# Altium schematic sheet ParentBoardV2.SchDoc: The conductor main board
size Letter; DrawnBy: IHC,CGH; Organization: The conductor; DocumentNumber: 1; Revision: 4; SheetNumber: 1; SheetTotal: 1
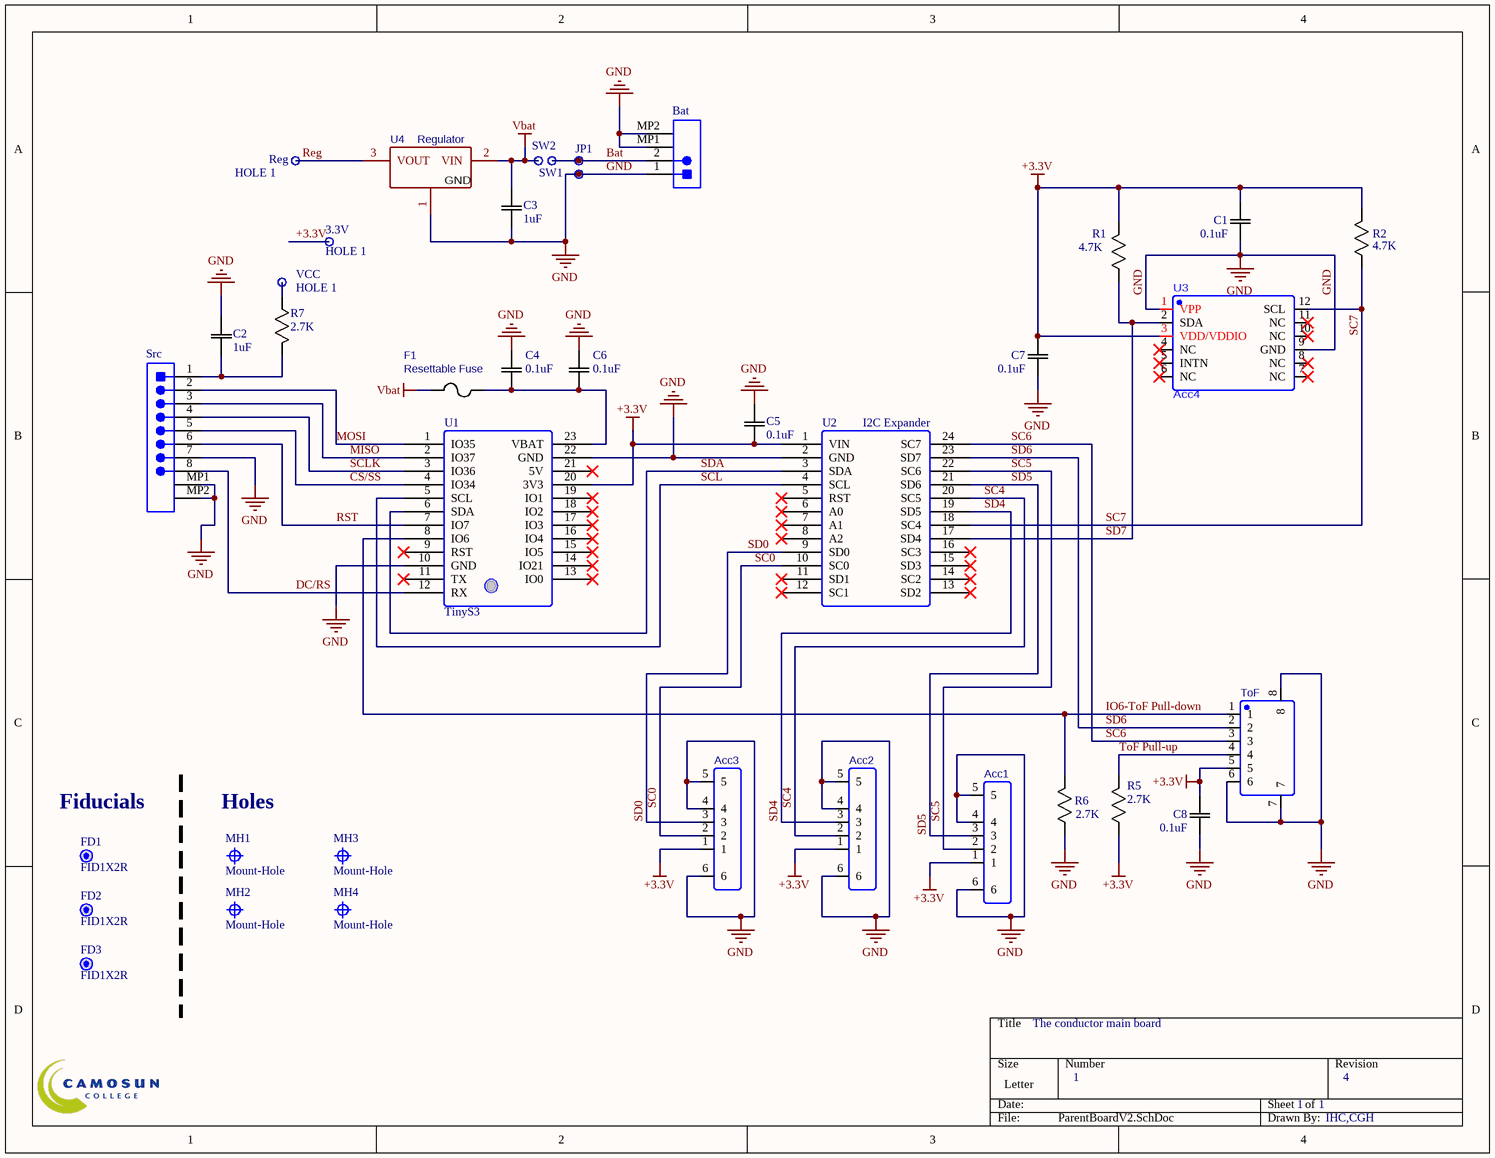
[diagram p0: ParentBoardV2.SchDoc]

## Parts
3.3V  HOLE 1  [RAD0.1C]
Acc1  SM04B-SRSS  [CONN-SMD_4P-P1.00_SM04B-SRSS-TB-LF-SN]  (value not drawn)
Acc2  SM04B-SRSS  [CONN-SMD_4P-P1.00_SM04B-SRSS-TB-LF-SN]  (value not drawn)
Acc3  SM04B-SRSS  [CONN-SMD_4P-P1.00_SM04B-SRSS-TB-LF-SN]  (value not drawn)
Bat  CN-1P-2M-R2  [JST- S2B-PH-SM4-TB(LF)(SN)-2_V]  (value not drawn)
C1  0.1uF  [CAP_AMK107BJ475MK-T_TAY]
C2  1uF  [CAP_AMK107BJ475MK-T_TAY]
C3  1uF  [CAP_AMK107BJ475MK-T_TAY]
C4  0.1uF  [CAP_AMK107BJ475MK-T_TAY]
C5  0.1uF  [CAP_AMK107BJ475MK-T_TAY]
C6  0.1uF  [CAP_AMK107BJ475MK-T_TAY]
C7  0.1uF  [CAP_AMK107BJ475MK-T_TAY]
C8  0.1uF  [CAP_AMK107BJ475MK-T_TAY]
F1  Resettable Fuse  [F0805]
FD1  FID1X2R  [Fiducial]
FD2  FID1X2R  [Fiducial]
FD3  FID1X2R  [Fiducial]
JP1  Battery  [RAD0.1]  (value not drawn)
MH1  Mount-Hole  [support 2 mm]
MH2  Mount-Hole  [support 2 mm]
MH3  Mount-Hole  [support 2 mm]
MH4  Mount-Hole  [support 2 mm]
R1  4.7K  [RC0603N_YAG]
R2  4.7K  [RC0603N_YAG]
R5  2.7K  [RC0603N_YAG]
R6  2.7K  [RC0603N_YAG]
R7  2.7K  [RC0603N_YAG]
Reg  HOLE 1  [RAD0.1C]
Src  SM08B-SRSS-TB(LF)(SN)  [JST-SM08B-SRSS-TB_V]  (value not drawn)
SW1  HOLE 1  [RAD0.1C]  (value not drawn)
SW2  HOLE 1  [RAD0.1C]  (value not drawn)
ToF  ToF sensor connector  [CONN-SMD_SM06B-SRSS-TB-LF-SN]  (value not drawn)
U1  TinyS3  [TinyS3]
U2  I2C Expander  [MODULE_2717]
U3  Acc4  [LGA-12_L2.0-W2.0-P0.50-BL]
U4  Regulator  [SOT89-150P350X160-3N]
VCC  HOLE 1  [RAD0.1C]

## Nets
+3.3V: 3.3V.1 Acc1.1 Acc2.1 Acc3.1 C1.2 C5.1 C7.2 C8.2 R1.1 R2.1 R5.2 ToF.5 U1.20(3V3) U2.1(VIN) U3.3(VDD/VDDIO)
GND: Acc1.4 Acc1.5 Acc1.6 Acc2.4 Acc2.5 Acc2.6 Acc3.4 Acc3.5 Acc3.6 Bat.1 Bat.MP1 Bat.MP2 C1.1 C2.2 C3.1 C4.2 C5.2 C6.2 C7.1 C8.1 JP1.1 R6.2 Src.7 Src.MP1 Src.MP2 ToF.6 ToF.7 ToF.8 U1.10(GND) U1.22(GND) U2.2(GND) U3.1(VPP) U3.9(GND) U4.1(GND)
Vbat: C3.2 F1.2 SW2.1 U4.2(VIN)
Bat: Bat.2 JP1.2 SW1.1
CS/SS: Src.5 U1.4(IO34)
DC/RS: Src.8 U1.12(RX)
IO6-ToF Pull-down: R6.1 ToF.1 U1.8(IO6)
MISO: Src.3 U1.2(IO37)
MOSI: Src.2 U1.1(IO35)
Reg: Reg.1 U4.3(VOUT)
RST: Src.6 U1.7(IO7)
SC0: Acc3.2 U2.10(SC0)
SC4: Acc2.2 U2.20(SC5)
SC5: Acc1.2 U2.22(SC6)
SC6: ToF.3 U2.24(SC7)
SC7: R2.2 U2.18(SC4) U3.12(SCL)
SCL: U1.5(SCL) U2.4(SCL)
SCLK: Src.4 U1.3(IO36)
SD0: Acc3.3 U2.9(SD0)
SD4: Acc2.3 U2.19(SD5)
SD5: Acc1.3 U2.21(SD6)
SD6: ToF.2 U2.23(SD7)
SD7: R1.2 U2.17(SD4) U3.2(SDA)
SDA: U1.6(SDA) U2.3(SDA)
ToF Pull-up: R5.1 ToF.4
NetC2_1: C2.1 R7.1 Src.1
NetC4_1: C4.1 C6.1 F1.1 U1.23(VBAT)
NetR7_2: R7.2 VCC.1

Not connected (* = marked no-connect by the designer): U1 9(RST)* 11(TX)* 13(IO0)* 14(IO21)* 15(IO5)* 16(IO4)* 17(IO3)* 18(IO2)* 19(IO1)* 21(5V)*; U2 5(RST)* 6(A0)* 7(A1)* 8(A2)* 11(SD1)* 12(SC1)* 13(SD2)* 14(SC2)* 15(SD3)* 16(SC3)*; U3 4(NC)* 5(INTN)* 6(NC)* 7(NC)* 8(NC)* 10(NC)* 11(NC)*

## Notes on the sheet
- (near FD1) Fiducials
- (near MH1) Holes

## Library data of the parts
Acc1-Acc3 = SM04B-SRSS-TB (LF)(SN): 4 pin JST connector; Contributor: LCSC; Supplier: LCSC; Supplier Part: C160404; Manufacturer: JST; Manufacturer Part: SM04B-SRSS-TB(LF)(SN); JLCPCB Part Class: Extended Part; spicePre: C; spiceSymbolName: SM04B-SRSS-TB (LF)(SN); LCSC PART #: C160404
Bat = CN-1P-2M-R2: 2 pin connector SMT 2 mm pitch; LCSC PART #: C295747
C1 C4-C8 = CL10B104KB8NNNC: SMT Capacitor 0.1 uF; Mfr_Name: Taiyo Yuden; Manufacturer_Part_Number: AMK107BJ475MK-T; Type: DEV; Copyright: Copyright (C) 2023 Ultra Librarian. All rights reserved.; Digi-Key_Part_Number_1: 587-2228-1-ND; Digi-Key_Part_Number_2: 587-2228-2-ND; Digi-Key_Part_Number_3: 587-2228-6-ND; RefDes: RefDes; LCSC PART #: C1591
C2 C3 = CL10B105KQ8NNNC: SMT Capacitor 1 uF; Mfr_Name: Taiyo Yuden; Manufacturer_Part_Number: AMK107BJ475MK-T; Type: DEV; Copyright: Copyright (C) 2023 Ultra Librarian. All rights reserved.; Digi-Key_Part_Number_1: 587-2228-1-ND; Digi-Key_Part_Number_2: 587-2228-2-ND; Digi-Key_Part_Number_3: 587-2228-6-ND; RefDes: RefDes; LCSC PART #: C105524
F1 = 0805L035YR: 6V 350mA 100A 750mA 0805 Resettable Fuses ROHS; Manufacturer: Littelfuse(美国力特); Contributor: LCSC; Supplier: LCSC; Supplier Part: C207021; Manufacturer Part: 0805L035YR; JLCPCB Part Class: Extended Part; spicePre: F; spiceSymbolName: 0805L035YR; LCSC PART #: C2687882
FD1-FD3 = FID1X2R: Fiducial - Round 1x2mm
JP1 = HOLE 2
MH1-MH4 = MountHoles 2 mm: Mount hole; LatestRevisionDate: 17-Jul-2002; LatestRevisionNote: Re-released for DXP Platform.; Publisher: Altium Limited
R1 R2 = RC0603JR-074K7L: SMT Resitor 4.7k; Mfr_Name: Yageo; Manufacturer_Part_Number: RC0603JR-072K7L; Copyright: Copyright (C) 2023 Ultra Librarian. All rights reserved.; Digi-Key_Part_Number_1: 311-2.7KGRCT-ND; Digi-Key_Part_Number_2: 311-2.7KGRDKR-ND; Digi-Key_Part_Number_3: 311-2.7KGRTR-ND; Digi-Key_Part_Number_4: 311-2.7KGRTR-NDL; RefDes: RefDes; Type: DEV; LCSC PART #: C105428
R5-R7 = RC0603JR-072K7L: SMT Resitor 2.7k; Mfr_Name: Yageo; Copyright: Copyright (C) 2023 Ultra Librarian. All rights reserved.; Manufacturer_Part_Number: RC0603JR-072K7L; Digi-Key_Part_Number_1: 311-2.7KGRCT-ND; Digi-Key_Part_Number_2: 311-2.7KGRDKR-ND; Digi-Key_Part_Number_3: 311-2.7KGRTR-ND; Digi-Key_Part_Number_4: 311-2.7KGRTR-NDL; RefDes: RefDes; Type: DEV; LCSC PART #: C127451
Src = CMP-2000-07082-1: Male Header, Pitch 1 mm, 1 x 8 Position, Height 2.95 mm, -25 to 85 degC, RoHS, Tape and Reel; Manufacturer: JST; Style/Orientation: RightAngleHeader/Plug; Pitch: 1mm; No of Positions: 8; Manufacturer URL: http://www.jst.com/home2.html; Mounting Technology: SurfaceMount; Package Description: Male Header, Pitch 1 mm, 1 x 8 Position, Height 2.95 mm; Datasheet URL: http://www.jst-mfg.com/product/pdf/eng/eSR.pdf; Type: ShroudedHeader; Termination: Crimp; Package Reference: SM08B-SRSS-TB; Datasheet Version: 11/2010; LCSC PART #: C160407
ToF = SM06B-SRSS-TB(LF)(SN): 6 pin connector; Manufacturer: JST; Contributor: LCSC; Supplier: LCSC; Supplier Part: C160405; Manufacturer Part: SM06B-SRSS-TB(LF)(SN); JLCPCB Part Class: Extended Part; spicePre: U; spiceSymbolName: SM06B-SRSS-TB(LF)(SN); LCSC PART #: C160405
U1 = TinyS3_1
U3 = MC3416-P: VLGA-12 Attitude Sensor/Gyroscope ROHS; LCSC PART #: MC3416-P
U4 = AP7380-33Y-13: Fixed 24V 3.3V 1.5V @ 150mA SOT-89-3 Linear Voltage Regulators (LDO) RoHS; Manufacturer: DIODES(美台); Contributor: LCSC; Supplier: LCSC; Supplier Part: C115096; Manufacturer Part: AP7380-33Y-13; JLCPCB Part Class: Extended Part; spicePre: U; spiceSymbolName: AP7380-33Y-13; LCSC PART #: C115096